# Altium project db44breakout.PrjPcb
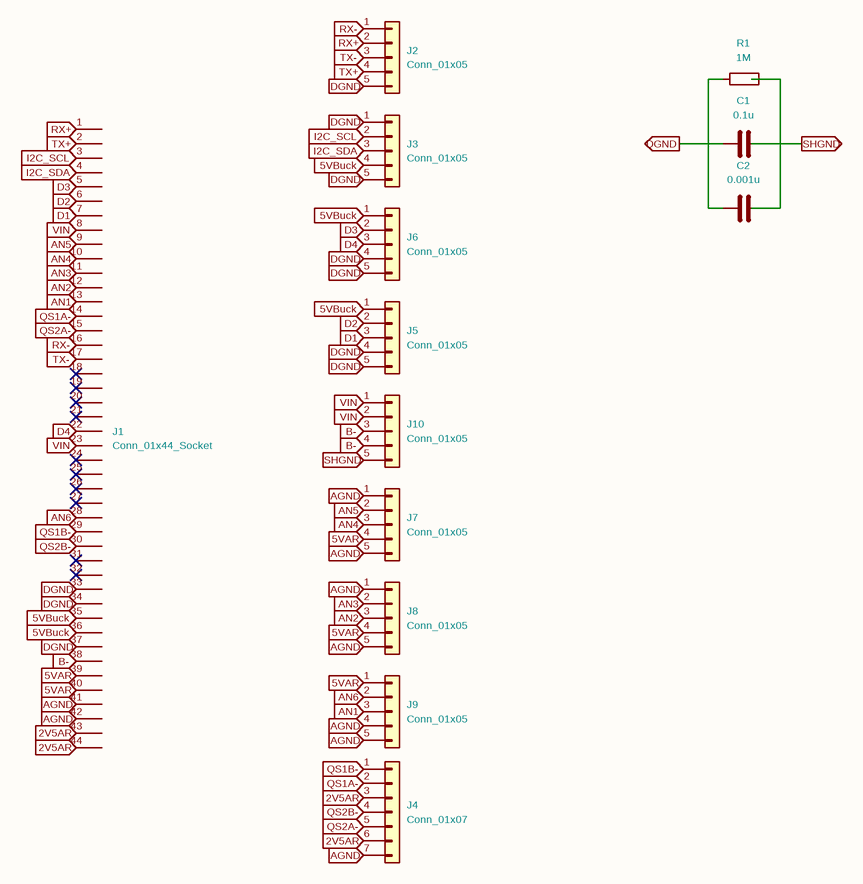
[diagram p0: db44breakout.SchDoc]
1 sheet, 13 parts. Net scope: flat (ports and power ports of the same name join across sheets).
Board files: db44breakout.PcbDoc, db44breakout(1).PcbDoc

## Sheet db44breakout.SchDoc
size 297 x 209 mm

### Parts
C1  0.1u  [C_0603_1608Metric]
C2  0.001u  [C_0603_1608Metric]
J1  Conn_01x44_Socket  [DSUB-44-HD_Female_Horizontal_P2.29x1.98mm_EdgePinOffset3.03mm_Housed_MountingHolesOffset4.94mm]
J2  Conn_01x05  [1x5WirePadsFront]
J3  Conn_01x05  [1x5WirePadsBack]
J4  Conn_01x07  [1x7WirePads]
J5  Conn_01x05  [1x5WirePadsBack]
J6  Conn_01x05  [1x5WirePadsFront]
J7  Conn_01x05  [1x5WirePadsBack]
J8  Conn_01x05  [1x5WirePadsFront]
J9  Conn_01x05  [1x5WirePadsBack]
J10  Conn_01x05  [1x5WirePadsFront]
R1  1M  [R_0603_1608Metric]

### Ports
2V5AR (out), 5VAR (out), 5VBuck (out), AGND (out), AN1 (out), AN2 (out), AN3 (out), AN4 (out), AN5 (out), AN6 (out), B- (out), D1 (out), D2 (out), D3 (out), D4 (out), DGND (out), I2C_SCL (out), I2C_SDA (out), QS1A- (out), QS1B- (out), QS2A- (out), QS2B- (out), RX+ (out), RX- (out), SHGND (out), TX+ (out), TX- (out), VIN (out)

### Nets
2V5AR: J1.43(Pin_43) J1.44(Pin_44) J4.3(Pin_3) J4.6(Pin_6) ; port 2V5AR
5VAR: J1.39(Pin_39) J1.40(Pin_40) J7.4(Pin_4) J8.4(Pin_4) J9.1(Pin_1) ; port 5VAR
5VBuck: J1.35(Pin_35) J1.36(Pin_36) J3.4(Pin_4) J5.1(Pin_1) J6.1(Pin_1) ; port 5VBuck
AGND: J1.41(Pin_41) J1.42(Pin_42) J4.7(Pin_7) J7.1(Pin_1) J7.5(Pin_5) J8.1(Pin_1) J8.5(Pin_5) J9.4(Pin_4) J9.5(Pin_5) ; port AGND
AN1: J1.13(Pin_13) J9.3(Pin_3) ; port AN1
AN2: J1.12(Pin_12) J8.3(Pin_3) ; port AN2
AN3: J1.11(Pin_11) J8.2(Pin_2) ; port AN3
AN4: J1.10(Pin_10) J7.3(Pin_3) ; port AN4
AN5: J1.9(Pin_9) J7.2(Pin_2) ; port AN5
AN6: J1.28(Pin_28) J9.2(Pin_2) ; port AN6
B-: J1.38(Pin_38) J10.3(Pin_3) J10.4(Pin_4) ; port B-
D1: J1.7(Pin_7) J5.3(Pin_3) ; port D1
D2: J1.6(Pin_6) J5.2(Pin_2) ; port D2
D3: J1.5(Pin_5) J6.2(Pin_2) ; port D3
D4: J1.22(Pin_22) J6.3(Pin_3) ; port D4
DGND: C1.1 C2.2 J1.33(Pin_33) J1.34(Pin_34) J1.37(Pin_37) J2.5(Pin_5) J3.1(Pin_1) J3.5(Pin_5) J5.4(Pin_4) J5.5(Pin_5) J6.4(Pin_4) J6.5(Pin_5) R1.1 ; port DGND
I2C_SCL: J1.3(Pin_3) J3.2(Pin_2) ; port I2C_SCL
I2C_SDA: J1.4(Pin_4) J3.3(Pin_3) ; port I2C_SDA
QS1A-: J1.14(Pin_14) J4.2(Pin_2) ; port QS1A-
QS1B-: J1.29(Pin_29) J4.1(Pin_1) ; port QS1B-
QS2A-: J1.15(Pin_15) J4.5(Pin_5) ; port QS2A-
QS2B-: J1.30(Pin_30) J4.4(Pin_4) ; port QS2B-
RX+: J1.1(Pin_1) J2.2(Pin_2) ; port RX+
RX-: J1.16(Pin_16) J2.1(Pin_1) ; port RX-
SHGND: C1.2 C2.1 J10.5(Pin_5) R1.2 ; port SHGND
TX+: J1.2(Pin_2) J2.4(Pin_4) ; port TX+
TX-: J1.17(Pin_17) J2.3(Pin_3) ; port TX-
VIN: J1.8(Pin_8) J1.23(Pin_23) J10.1(Pin_1) J10.2(Pin_2) ; port VIN

Not connected (* = marked no-connect by the designer): J1 18(Pin_18)* 19(Pin_19)* 20(Pin_20)* 21(Pin_21)* 24(Pin_24)* 25(Pin_25)* 26(Pin_26)* 27(Pin_27)* 31(Pin_31)* 32(Pin_32)*

### Notes on the sheet
- 1
- 2
- 3
- 4
- 5
- 6
- A
- B
- C
- D
- Title:
- File: db44breakout.kicad_sch
- Sheet: /
- KiCad E.D.A.  kicad (5.1.4)-1
- Size: A4
- Date:
- Rev:
- Id: 1/1

### Library data of the parts
C1 C2 = C: Description: Unpolarized capacitor; Footprint: Capacitor_SMD:C_0603_1608Metric
  C1: Value: 0.1u
  C2: Value: 0.001u
J1 = Conn_01x44_Socket: Description: "Generic connector, single row, 01x44, script generated"; Value: Conn_01x44_Socket; Footprint: Connector_Dsub:DSUB-44-HD_Female_Horizontal_P2.29x1.98mm_EdgePinOffset3.03mm_Housed_MountingHolesOffset4.94mm
J2 J3 J5-J10 = Conn_01x05: Description: Generic connector, single row, 01x05, script generated (kicad-library-utils/schlib/autogen/connector/); Value: Conn_01x05
  J2 J6 J8 J10: Footprint: Connector_Wire:1x5WirePadsFront
  J3 J5 J7 J9: Footprint: Connector_Wire:1x5WirePadsBack
J4 = Conn_01x07: Description: Generic connector, single row, 01x07, script generated (kicad-library-utils/schlib/autogen/connector/); Value: Conn_01x07; Footprint: Connector_Wire:1x7WirePads
R1 = R: Description: Resistor; Value: 1M; Footprint: Resistor_SMD:R_0603_1608Metric